# EAGLE design Chime PCB v2 (EAGLE 9.6.2)
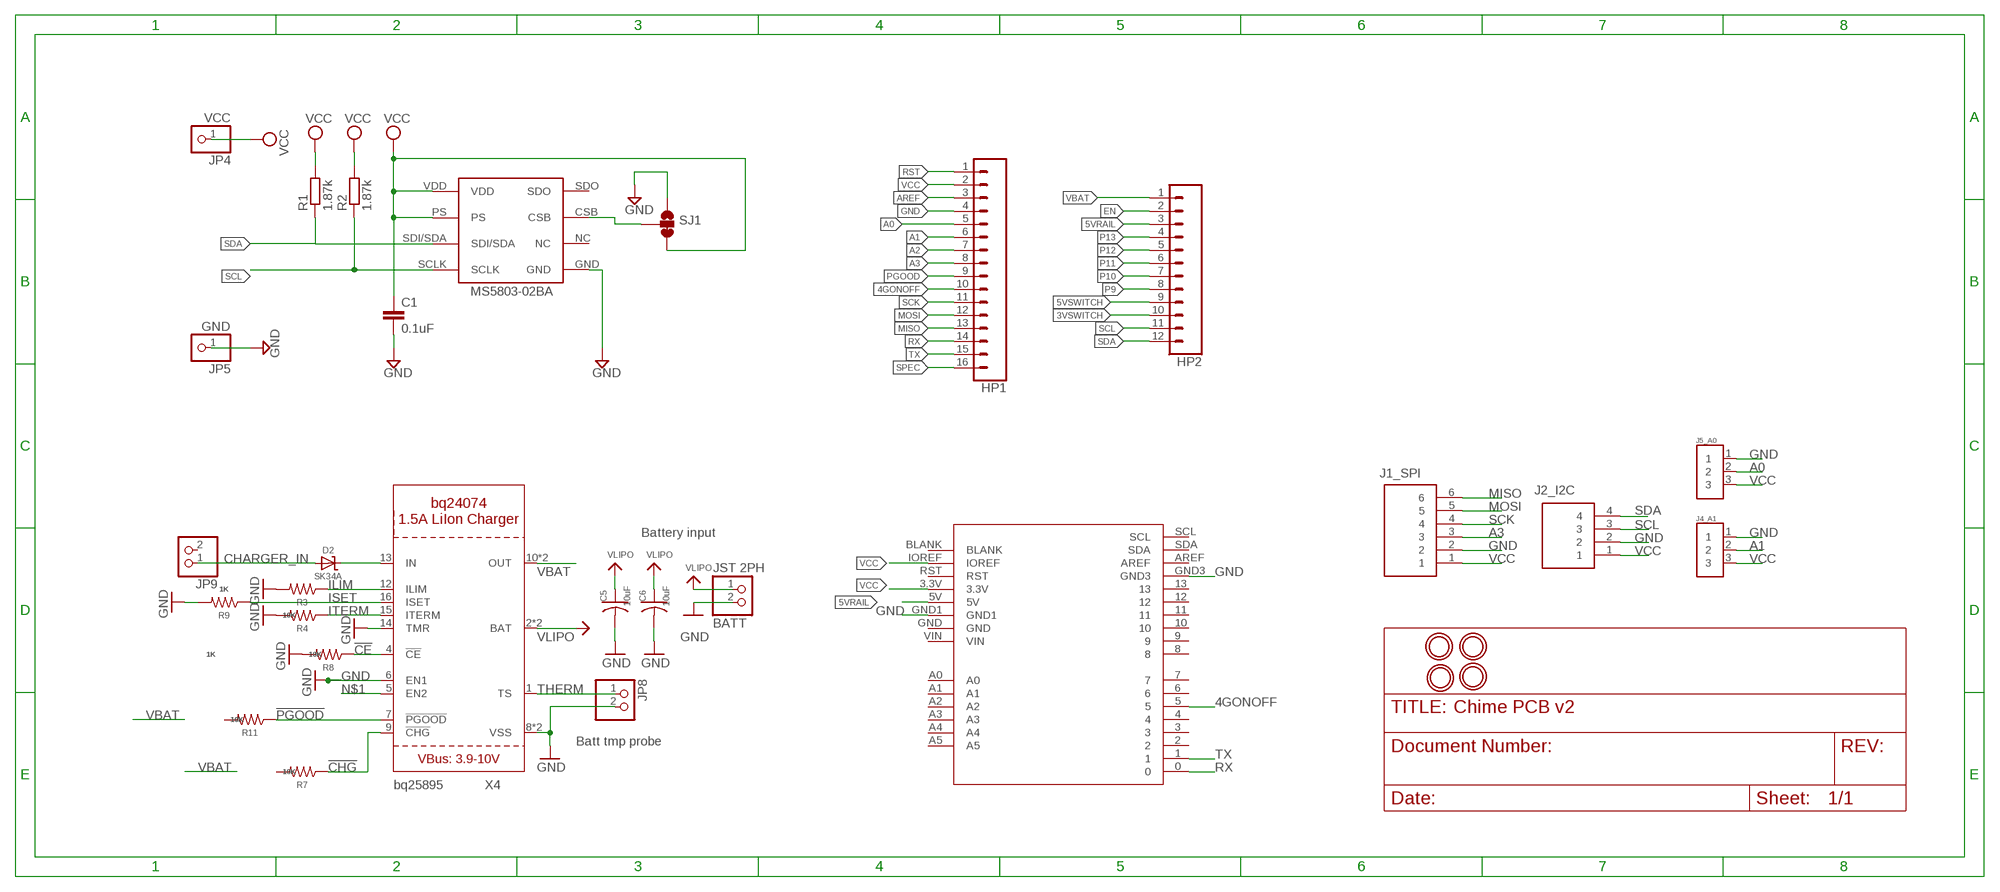
[diagram p0: schematic, sheet 1]

## Parts
BATT  JST 2PH  JST_2PIN-SMT-RA  [JST-PH-2-SMT-RA]
C1  0.1uF  C-EUC0805  [C0805]
C5  10uF  C-USC0805K  [C0805K]
C6  10uF  C-USC0805K  [C0805K]
D2  SK34A  DIODE-SCHOTTKYSMA  [SMADIODE]
HP1  CONN_16  [1X16]
HP2  CONN_12  [1X12]
J1_SPI  1725698  [1725698]
J2_I2C  1725672  [1725672]
J4_A1  282834-3  [TE_282834-3]
J5_A0  282834-3  [TE_282834-3]
JP4  VCC  PINHD-1X1  [1X01]
JP5  GND  PINHD-1X1  [1X01]
JP8  PINHD-1X2  [1X02]
JP9  PINHD-1X2  [1X02]
R1  1.87k  R-EU_R0805  [R0805]
R2  1.87k  R-EU_R0805  [R0805]
R3  1K  R-US_M0805  [M0805]
R4  10K  R-US_M0805  [M0805]
R7  10K  R-US_M0805  [M0805]
R8  10K  R-US_M0805  [M0805]
R9  1K  R-US_M0805  [M0805]
R11  10K  R-US_M0805  [M0805]
SJ1  JUMPER-SMT_3_1-NC_TRACE_SILK  [SMT-JUMPER_3_1-NC_TRACE_SILK]
U1  MS5803-02BA  [MS5803-02BA]
U$1  LTE_BOARD  [LTE_BOARD_FOOTPRINT]
U$2  MOUNTINGHOLE2.5  [MOUNTINGHOLE_2.5_PLATED]
U$3  MOUNTINGHOLE2.5  [MOUNTINGHOLE_2.5_PLATED]
U$4  MOUNTINGHOLE2.5  [MOUNTINGHOLE_2.5_PLATED]
U$5  MOUNTINGHOLE2.5  [MOUNTINGHOLE_2.5_PLATED]
X4  BQ24074  [QFN16_3MM]

## Nets
3VSWITCH: HP2.10
4GONOFF: HP1.10 U$1.5
5VRAIL: HP2.3 U$1.5V
5VSWITCH: HP2.9
!CE: R8.1 X4.4(!CE)
!CHG: R7.1 X4.9(!CHG)
!PGOOD: R11.1 X4.7(!PGOOD)
A0: HP1.5 J5_A0.2
A1: HP1.6 J4_A1.2
A2: HP1.7
A3: HP1.8 J1_SPI.3
AREF: HP1.3
CHARGER_IN: D2.A JP9.1
EN: HP2.2
GND: BATT.2 C1.2 C5.2 C6.2 HP1.4 J1_SPI.2 J2_I2C.2 J4_A1.1 J5_A0.1 JP5.1 JP8.2 R3.2 R4.2 R8.2 R9.2 SJ1.1 U1.GND U$1.GND1 U$1.GND3 X4.6(EN1) X4.8(VSS) X4.14(TMR) X4.THERMAL(VSS)
ILIM: R3.1 X4.12(ILIM)
ISET: R9.1 X4.16(ISET)
ITERM: R4.1 X4.15(ITERM)
MISO: HP1.13 J1_SPI.6
MOSI: HP1.12 J1_SPI.5
N$1: X4.5(EN2)
N$2: D2.C X4.13(IN)
N$3: SJ1.2 U1.CSB
P9: HP2.8
P10: HP2.7
P11: HP2.6
P12: HP2.5
P13: HP2.4
PGOOD: HP1.9
RST: HP1.1
RX: HP1.14 U$1.0
SCK: HP1.11 J1_SPI.4
SCL: HP2.11 J2_I2C.3 R2.1 U1.SCLK
SDA: HP2.12 J2_I2C.4 R1.1 U1.SDI/SDA
SPEC: HP1.16
THERM: JP8.1 X4.1(TS)
TX: HP1.15 U$1.1
VBAT: HP2.1 X4.10(OUT) X4.11(OUT)
VCC: C1.1 HP1.2 J1_SPI.1 J2_I2C.1 J4_A1.3 J5_A0.3 JP4.1 R1.2 R2.2 SJ1.3 U1.PS U1.VDD U$1.3.3V U$1.IOREF
VLIPO: BATT.1 C5.1 C6.1 X4.2(BAT) X4.3(BAT)
Unconnected: JP9.2 R7.2 R11.2 U1.NC U1.SDO U$1.2 U$1.3 U$1.4 U$1.6 U$1.7 U$1.8 U$1.9 U$1.10 U$1.11 U$1.12 U$1.13 U$1.A0 U$1.A1 U$1.A2 U$1.A3 U$1.A4 U$1.A5 U$1.AREF U$1.BLANK U$1.GND U$1.RST U$1.SCL U$1.SDA U$1.VIN

## Notes on the sheet
- Battery input
- Batt tmp probe

## Library data of the parts
BATT = adafruit:JST_2PIN: JST 2-Pin Connectors of various flavors SMT-RA (S2B-PH-SM4) 4UConnector #17311 SMT (B2B-PH-SM4) THM-RA (S2B-PH) THM (B2B-PH)
C1 = rcl:C-EU: CAPACITOR, European symbol; SPICEPREFIX: C
C5 C6 = adafruit:C-US: CAPACITOR, American symbol
D2 = microbuilder:DIODE-SCHOTTKY
HP1 = SparkFun-Connectors:CONN_16: Multi connection point. Often used as Generic Header-pin footprint for 0.1 inch spaced/style header connections On any of the 0.1 inch spaced packages, you can populate with these: Break Away Headers - Straight <https://www.sparkfun.com/products/116> (PRT-00116) Break Away Male Headers - Right Angle <https://www.sparkfun.com/products/553> (PRT-00553) Female Headers <https://www.sparkfun.com/products/115> (PRT-00115) Break Away Headers - Machine Pin <https://www.sparkfun.com/products/117> (PRT-00117) Break Away Female Headers - Swiss Machine Pin <https://www.sparkfun.com/products/743> (PRT-00743) For SCREWTERMINALS and SPRING TERMINALS visit here: Screw Terimnals on SparkFun.com <https://www.sparkfun.com/search/results?term=Screw+Terminals> (5mm/3.5mm/2.54mm spacing) This device is also useful as a general connection point to wire up your design to another part of your project. Our various solder wires solder well into these plated through hole pads. Hook-Up Wire - Assortment (Stranded, 22 AWG) <https://www.sparkfun.com/products/11375> (PRT-11375) Hook-Up Wire - Assortment (Solid Core, 22 AWG) <https://www.sparkfun.com/products/11367> (PRT-11367) View the entire wire category on our website here <https://www.sparkfun.com/categories/141> Special notes: Molex polarized connector foot print use with SKU : PRT-08231 with associated crimp pins and housings. 1MM SMD Version SKU: PRT-10208 NOTES ON THE VARIANTS LOCK and LOCK_LONGPADS... This footprint was designed to help hold the alignment of a through-hole component (i.e. 6-pin header) while soldering it into place. You may notice that each hole has been shifted either up or down by 0.005 of an inch from it's more standard position (which is a perfectly straight line). This slight alteration caused the pins (the squares in the middle) to touch the edges of the holes. Because they are alternating, it causes a "brace" to hold the component in place. 0.005 has proven to be the perfect amount of "off-center" position when using our standard breakaway headers. Although looks a little odd when you look at the bare footprint, once you have a header in there, the alteration is very hard to notice. Also,if you push a header all the way into place, it is covered up entirely on the bottom side.
HP2 = SparkFun-Connectors:CONN_12: Multi connection point. Often used as Generic Header-pin footprint for 0.1 inch spaced/style header connections On any of the 0.1 inch spaced packages, you can populate with these: Break Away Headers - Straight <https://www.sparkfun.com/products/116> (PRT-00116) Break Away Male Headers - Right Angle <https://www.sparkfun.com/products/553> (PRT-00553) Female Headers <https://www.sparkfun.com/products/115> (PRT-00115) Break Away Headers - Machine Pin <https://www.sparkfun.com/products/117> (PRT-00117) Break Away Female Headers - Swiss Machine Pin <https://www.sparkfun.com/products/743> (PRT-00743) For SCREWTERMINALS and SPRING TERMINALS visit here: Screw Terimnals on SparkFun.com <https://www.sparkfun.com/search/results?term=Screw+Terminals> (5mm/3.5mm/2.54mm spacing) This device is also useful as a general connection point to wire up your design to another part of your project. Our various solder wires solder well into these plated through hole pads. Hook-Up Wire - Assortment (Stranded, 22 AWG) <https://www.sparkfun.com/products/11375> (PRT-11375) Hook-Up Wire - Assortment (Solid Core, 22 AWG) <https://www.sparkfun.com/products/11367> (PRT-11367) View the entire wire category on our website here <https://www.sparkfun.com/categories/141> Special notes: Molex polarized connector foot print use with SKU : PRT-08231 with associated crimp pins and housings. 1MM SMD Version SKU: PRT-10208 NOTES ON THE VARIANTS LOCK and LOCK_LONGPADS... This footprint was designed to help hold the alignment of a through-hole component (i.e. 6-pin header) while soldering it into place. You may notice that each hole has been shifted either up or down by 0.005 of an inch from it's more standard position (which is a perfectly straight line). This slight alteration caused the pins (the squares in the middle) to touch the edges of the holes. Because they are alternating, it causes a "brace" to hold the component in place. 0.005 has proven to be the perfect amount of "off-center" position when using our standard breakaway headers. Although looks a little odd when you look at the bare footprint, once you have a header in there, the alteration is very hard to notice. Also,if you push a header all the way into place, it is covered up entirely on the bottom side.
J1_SPI = 1725698:1725698: Conn PC Terminal Block 6 POS 2.54mm Solder ST Thru-Hole 6A Source: Datasheet <https://www.phoenixcontact.com/online/portal/us/pxc/product_detail_page/!ut/p/z1/5Vddc6IwFP0r7oNvxYSPBHhEdNda6-KKW-GFISE6tHwVUmn76zeonY7dVmfH8WEH5s6QhHtv7jnJYeYCHyyBn4WbeB3yOM_CRMw9Hwdu3x0OHQXLP2eoD68HyB5OtF_yaKqA38AHfsUSRjmL7JCzdV6-AM-aTJoPPCTAk5tRQekD8B>; ARROW_PART_NUMBER: 1725698; ARROW_PRICE-STOCK: https://www.arrow.com/en/products/1725698/phoenix-contact?region=nac; DESCRIPTION: Conn PC Terminal Block 6 POS 2.54mm Solder ST Thru-Hole 6A; HEIGHT: 8.65mm; MANUFACTURER_NAME: Phoenix Contact; MANUFACTURER_PART_NUMBER: 1725698; MOUSER_PART_NUMBER: 651-1725698; MOUSER_PRICE-STOCK: https://www.mouser.co.uk/ProductDetail/Phoenix-Contact/1725698?qs=Ul7CXFMnlWUIR3VpVwwC4A%3D%3D
J2_I2C = 1725672:1725672: 4 way vertical PCB terminal,6A 63V Phoenix Contact Non-Fused Terminal Block, 4 Way, Solder Terminals, 26 ??? 20 AWG Through Hole, Nylon, 63 V Source: Datasheet <https://datasheet.datasheetarchive.com/originals/distributors/SFDatasheet-2/sf-00050602.pdf>; ARROW_PART_NUMBER: 1725672; ARROW_PRICE-STOCK: https://www.arrow.com/en/products/1725672/phoenix-contact?region=nac; DESCRIPTION: 4 way vertical PCB terminal,6A 63V Phoenix Contact Non-Fused Terminal Block, 4 Way, Solder Terminals, 26 ??? 20 AWG Through Hole, Nylon, 63 V; HEIGHT: 8.65mm; MANUFACTURER_NAME: Phoenix Contact; MANUFACTURER_PART_NUMBER: 1725672; MOUSER_PART_NUMBER: 651-1725672; MOUSER_PRICE-STOCK: https://www.mouser.co.uk/ProductDetail/Phoenix-Contact/1725672?qs=Ul7CXFMnlWXX93F9bOV2pQ%3D%3D
J4_A1 J5_A0 = Fixed Terminal Blocks 3P:282834-3: Conn; Term Blk; PCB; Wire Receptacle; 3; 2.54mm; 30-16AWG; Green; 10A; 150V; M1.6 Check availability <https://pricing.snapeda.com/parts/282834-3/TE%20Connectivity/view-part?ref=eda>; AVAILABILITY: In Stock; COMMENT: 282834-3; DESCRIPTION: 3 Position Wire to Board Terminal Block Horizontal with Board 0.100 (2.54mm); EU_ROHS_COMPLIANCE: Compliant with Exemptions; MF: TE Connectivity; MP: 282834-3; PACKAGE: None; PRICE: None; PURCHASE-URL: https://pricing.snapeda.com/search/part/282834-3/?ref=eda
JP4 JP5 = pinhead_simple:PINHD-1X1: PIN HEADER
JP8 JP9 = pinhead:PINHD-1X2: PIN HEADER
R1 R2 = rcl:R-EU_: RESISTOR, European symbol; SPICEPREFIX: R
R3 R4 R7-R9 R11 = adafruit:R-US_: RESISTOR, American symbol
SJ1 = SparkFun-Jumpers:JUMPER-SMT_3_1-NC_TRACE: Normally closed trace jumper (1 of 2 connections) This jumper has a trace between two pads so it's normally closed (NC). The other connection is normally open (NO). Use a razor knife to open the connection. For best results follow the IPC guidelines for cutting traces: Cutout at least 0.063 mm (0.005 in). Remove all loose material to clean up the cut area. Seal the cut with an approved epoxy. Reapply solder to reclose the connection, or to close the NO connection.
U1 = PNNL_Probe:MS5803-02BA
U$1 = LTE_BOARD_LOOM:LTE_BOARD: LTE_BOARD
U$2-U$5 = microbuilder:MOUNTINGHOLE: Mounting Hole For #2 screws (0.086"/2.18mm width, 0.094"/2.4mm hole) use 2.5mm; BOM: EXCLUDE
X4 = adafruit_power:BQ24074

## Board
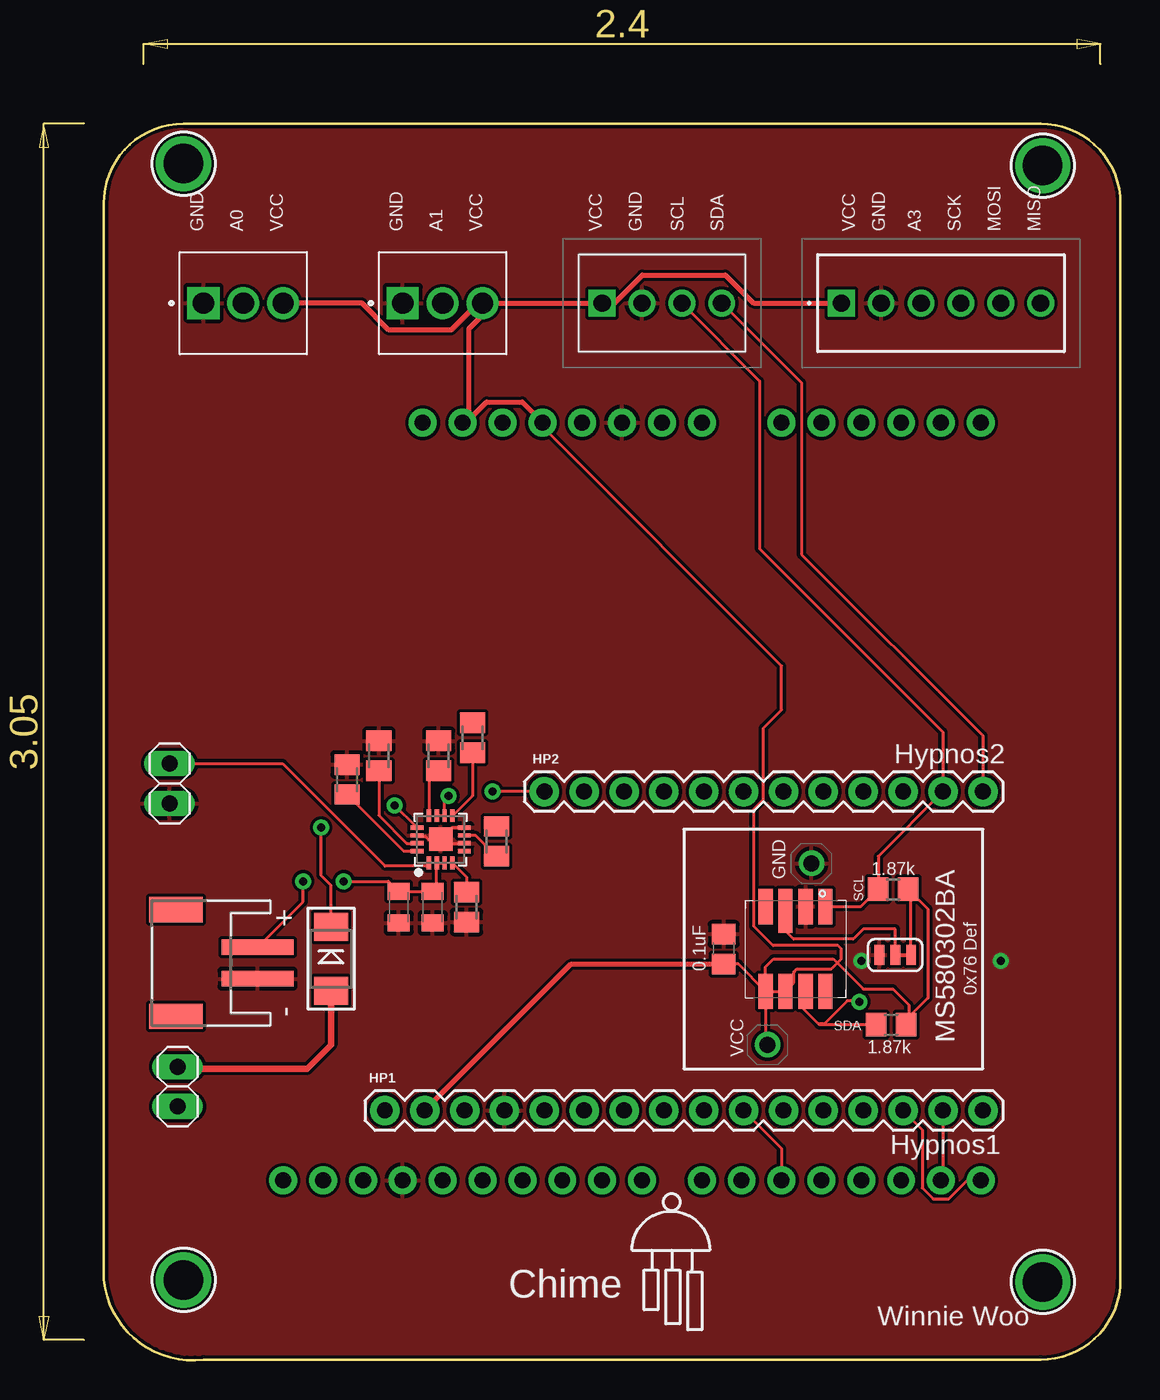
[diagram p1: board, top side]
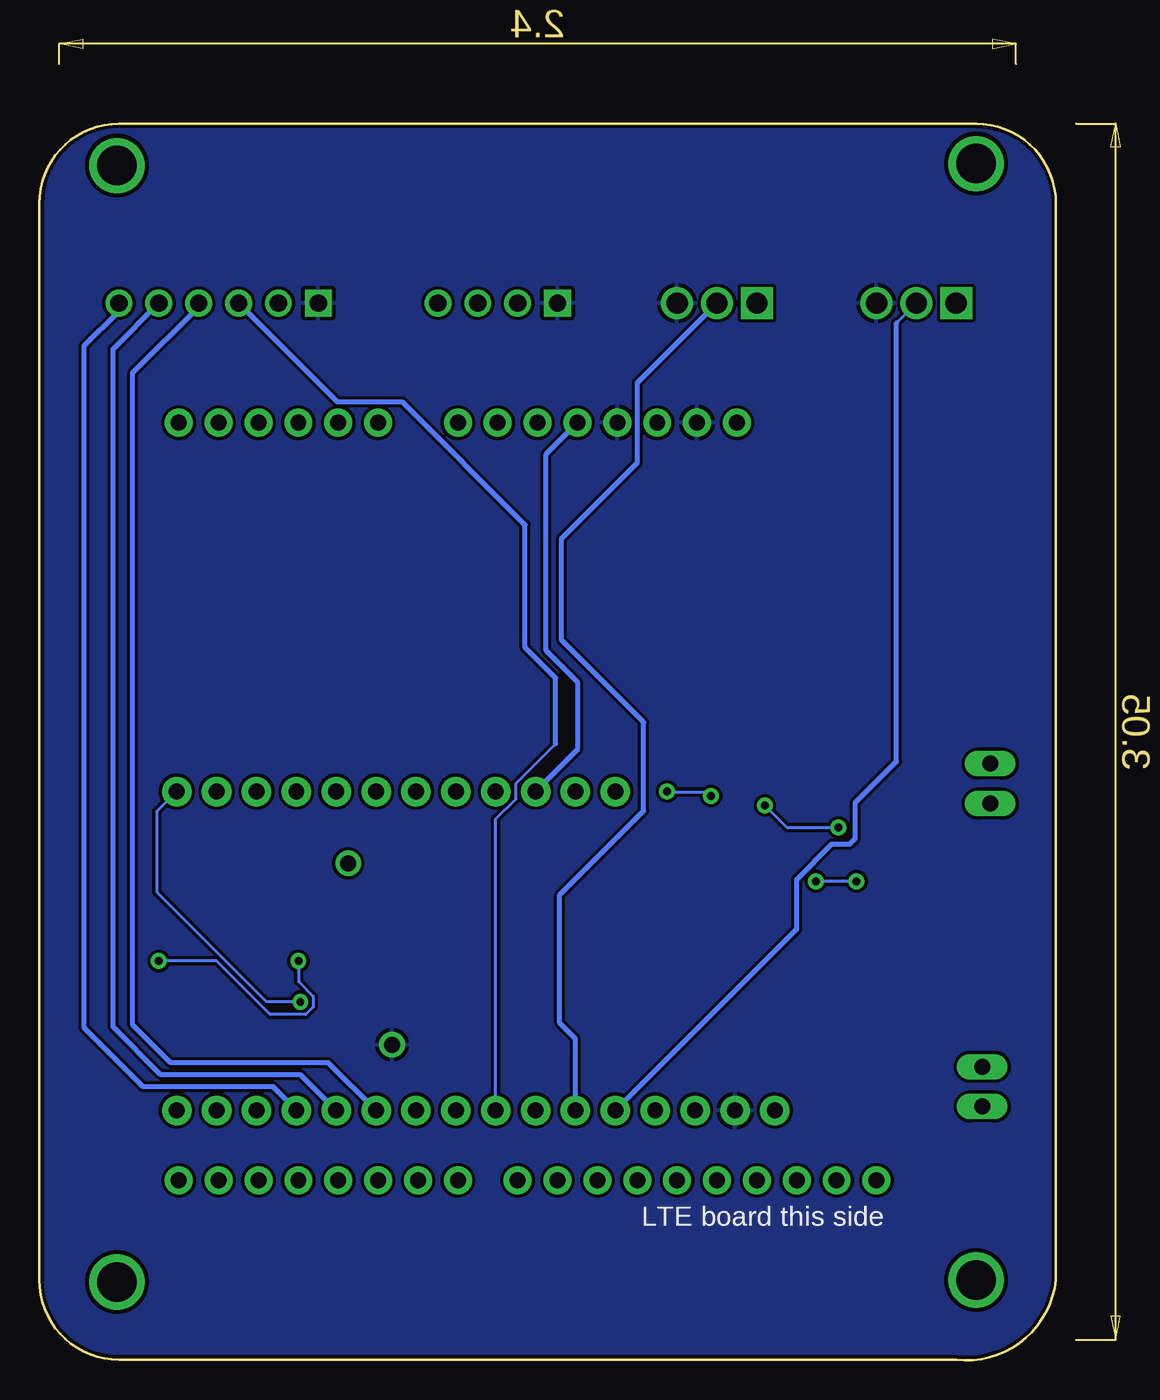
[diagram p2: board, bottom side, seen from below]

Size 64.77 x 78.77 mm. Coordinates in mm from the lower left corner, seen from the top.
Outline: 5.08,78.77 59.69,78.77 arc-90 64.77,73.69 64.77,5.11 arc-90 59.69,0.03 6.35,0.03 arc-90 0,5.11 0,73.69 arc-90 5.08,78.77
Copper layers (1*16): Top 0.035mm / dielectric 1.5mm / Bottom 0.035mm
Design rules "SparkFun": minimum track width 8mil, minimum drill 20mil, track to track 8mil, track to pad 8mil, pad to pad 8mil, via to via 8mil, smd to smd 8mil, copper to edge 8mil, drill to drill 8mil, minimum pad ring 12mil, minimum via ring 10mil, stop-mask expansion 4mil, vias tented up to drill 20mil, thermal gap 10mil

### Footprints (pad centres in the part's own frame; a part is rotated, then mirrored left to right if it is on the bottom)
JST-PH-2-SMT-RA = smd 1 x 4.6: 1 1,-3.7; 2 -1,-3.7 | smd 1.6 x 3.4: NC1 -3.4,1.5; NC2 3.4,1.5
C0805 = smd 1.3 x 1.5: 1 -0.95,0; 2 0.95,0
C0805K = smd 1.1 x 1.4: 1 -1,0; 2 1,0
SMADIODE = smd 1.778 x 2.159: A 2.019,0; C -2.045,0
1X16 = drill 1.016 pad 1.88: 1 0,0; 2 2.54,0; 3 5.08,0; 4 7.62,0; 5 10.16,0; 6 12.7,0; 7 15.24,0; 8 17.78,0; 9 20.32,0; 10 22.86,0; 11 25.4,0; 12 27.94,0; 13 30.48,0; 14 33.02,0; 15 35.56,0; 16 38.1,0
1X12 = drill 1.016 pad 1.88: 1 0,0; 2 2.54,0; 3 5.08,0; 4 7.62,0; 5 10.16,0; 6 12.7,0; 7 15.24,0; 8 17.78,0; 9 20.32,0; 10 22.86,0; 11 25.4,0; 12 27.94,0
1725698 = drill 1.1 pad 1.65 square: 1 0,0 | drill 1.1 pad 1.65: 2 2.54,0; 3 5.08,0; 4 7.62,0; 5 10.16,0; 6 12.7,0
1725672 = drill 1.1 pad 1.65 square: 1 0,0 | drill 1.1 pad 1.65: 2 2.54,0; 3 5.08,0; 4 7.62,0
TE_282834-3 = drill 1.36 square: 1 0,0 | drill 1.36: 2 2.54,0; 3 5.08,0
1X01 = drill 1.016: 1 0,0
1X02 = drill 1.016 long: 1 -1.27,0; 2 1.27,0
R0805 = smd 1.3 x 1.5: 1 -0.95,0; 2 0.95,0
M0805 = smd 1.3 x 1.6: 1 -0.95,0; 2 0.95,0
SMT-JUMPER_3_1-NC_TRACE_SILK = smd 0.635 x 1.27: 1 -1.016,0; 2 0,0; 3 1.016,0
MS5803-02BA = smd 2.8 x 0.9: CSB 2.42,0.65 | smd 2.25 x 0.9: GND 2.7,-0.65; NC 2.7,1.9; PS -2.7,0.65; SCLK 2.7,-1.9; SDI/SDA -2.7,-0.65; SDO -2.7,-1.9; VDD -2.7,1.9
LTE_BOARD_FOOTPRINT = drill 1.016 pad 1.778: 0 35.56,48.26; 1 33.02,48.26; 2 30.48,48.26; 3 27.94,48.26; 3.3V 7.62,0; 4 25.4,48.26; 5 22.86,48.26; 5V 10.16,0; 6 20.32,48.26; 7 17.78,48.26; 8 13.97,48.26; 9 11.43,48.26; 10 8.89,48.26; 11 6.35,48.26; 12 3.81,48.26; 13 1.27,48.26; A0 22.86,0; A1 25.4,0; A2 27.94,0; A3 30.48,0; A4 33.02,0; A5 35.56,0; AREF -3.81,48.26; BLANK 0,0; GND 15.24,0; GND1 12.7,0; GND3 -1.27,48.26; IOREF 2.54,0; RST 5.08,0; SCL -8.89,48.26; SDA -6.35,48.26; VIN 17.78,0
MOUNTINGHOLE_2.5_PLATED = drill 2.5 pad 3.2: P$1 0,0
QFN16_3MM = smd 0.8 x 0.28: 1 -1.5,0.75; 2 -1.5,0.25; 3 -1.5,-0.25; 4 -1.5,-0.75; 9 1.5,-0.75; 10 1.5,-0.25; 11 1.5,0.25; 12 1.5,0.75 | smd 0.28 x 0.8: 5 -0.75,-1.5; 6 -0.25,-1.5; 7 0.25,-1.5; 8 0.75,-1.5; 13 0.75,1.5; 14 0.25,1.5; 15 -0.25,1.5; 16 -0.75,1.5 | smd 1.5 x 1.5: THERMAL 0,0

### Placement (x,y rotation side)
BATT  6.1,25.31 90 top
C1  39.5,26.2 90 top
C5  20.95,28.86 270 top
C6  18.8,28.86 270 top
D2  14.48,25.56 270 top
HP1  17.91,15.91 0 top
HP2  28.07,36.23 0 top
J1_SPI  46.99,67.34 0 top
J2_I2C  31.75,67.34 0 top
J4_A1  19.05,67.34 0 top
J5_A0  6.35,67.34 0 top
JP4  42.29,20.1 90 top
JP5  45.09,31.66 90 top
JP8  4.19,36.74 270 top
JP9  4.7,17.43 270 top
R1  50.17,21.37 0 top
R2  50.29,30.01 0 top
R3  21.34,38.52 90 top
R4  17.53,38.52 90 top
R7  23.5,39.66 90 top
R8  23.11,28.86 270 top
R9  15.49,36.99 90 top
R11  25.02,33.05 90 top
SJ1  50.42,25.82 0 top
U1  44.07,26.2 90 top
U$1  20.32,59.72 180 bottom
U$2  5.08,5.11 0 top
U$3  5.08,76.23 0 top
U$4  59.82,76.11 0 top
U$5  59.82,4.99 0 top
X4  21.46,33.18 90 top

### Tracks (layer width: path | path; a pad name or v marks a point on that pad's centre or on a via)
4GONOFF
  Top 0.203: HP1.10 43.18,13.5 U$1.5
5VRAIL
  Bottom 0.305: HP2.3 30.48,38.9 30.48,43.21 32.51,45.25 32.51,57.69 U$1.5V
!CE
  Top 0.203: X4.4 23.11,30.78 R8.1
!CHG
  Top 0.203: R7.1 23.5,35.96 X4.9
!PGOOD
  Top 0.203: R11.1 23.69,33.43 X4.7
A0
  Bottom 0.203: 10.16,66.07 J5_A0.2
  Bottom 0.305: 10.16,66.07 10.16,38.13 12.78,35.52 12.78,33.23 13.12,32.88 14.28,32.88 16.51,30.64 16.51,27.47 HP1.5
A1
  Bottom 0.305: J4_A1.2 26.67,62.26 26.67,57.18 31.5,52.36 31.5,45.88 26.26,40.65 26.26,35 31.62,29.64 31.62,21.5 30.61,20.48 HP1.6
A3
  Bottom 0.203: HP1.8 35.69,34.47 34.39,35.76 34.39,36.75 31.88,39.26
  Bottom 0.305: J1_SPI.3 45.77,61.05 41.63,61.05 33.81,53.22 33.81,45.4 31.88,43.47 31.88,39.26
CHARGER_IN
  Top 0.203: JP9.1 4.83,18.58
  Top 0.406: 4.83,18.58 12.95,18.58 14.48,20.1 D2.A
GND  (via drill 0.51)
  Top 0.203: X4.14 20.02,33.38 20.49,33.38 20.68,33.18 X4.THERMAL | X4.THERMAL 21.71,32.93 X4.6 | X4.THERMAL 22.21,33.93 X4.8
  Bottom 0.203: v57.15,25.43 53.46,25.43 50.05,22.03 47.8,22.03 47.32,22.51 47.32,23.18 48.26,24.12 v48.26,25.43
  pour Top: 0,78.77 64.77,78.77 64.77,0.03 0,0.03
  pour Top: 0,78.77 64.77,78.77 64.77,0.03 0,0.03
ILIM
  Top 0.203: R3.1 20.71,36.94 X4.12
ISET
  Top 0.203: R9.1 19.1,32.43 X4.16
ITERM
  Top 0.203: R4.1 17.53,34.71 19.31,32.93 X4.15
MISO
  Bottom 0.305: J1_SPI.6 59.69,66.84 61.94,64.59 61.94,21.2 58.17,17.43 49.91,17.43 HP1.13
MOSI
  Bottom 0.305: HP1.12 48.13,18.2 57.02,18.2 60.07,21.24 60.07,64.42 J1_SPI.5
N$2  (via drill 0.51)
  Top 0.203: X4.13 v18.54,35.34 | D2.C 14.48,30.26 13.84,30.9 v13.84,33.94
  Bottom 0.203: v18.54,35.34 17.14,33.94 v13.84,33.94
N$3
  Top 0.203: U1.CSB 43.42,27.35 43.94,26.83 47.75,26.83 48.39,27.47 50.42,27.47 SJ1.2
RX
  Top 0.203: HP1.14 52.15,14.69 52.15,10.97 52.85,10.27 53.83,10.27 55.03,11.46 U$1.0
SCK
  Bottom 0.305: HP1.11 46.36,18.96 56.39,18.96 58.8,21.37 58.8,62.91 54.61,67.1 J1_SPI.4
SCL
  Top 0.203: U1.SCLK 48.23,28.9 R2.1 49.34,32.1 HP2.11 53.47,40.02 41.78,51.71 41.78,62.39 J2_I2C.3
SDA  (via drill 0.51)
  Top 0.203: R1.1 45.59,21.37 45.53,21.43 | 45.53,21.43 44.58,22.39 44.58,23.35 U1.SDI/SDA | v48.13,22.84 48.08,22.89 47.37,22.89 45.91,21.43 45.53,21.43 | J2_I2C.4 44.45,62.26 44.45,51.34 56.01,39.79 HP2.12
  Bottom 0.203: v48.13,22.84 50.29,22.84 57.28,29.83 57.28,34.96 HP2.12
THERM
  Top 0.203: JP8.1 11.39,38.01 17.92,31.48 20.51,31.48 X4.1
TX
  Top 0.203: HP1.15 53.47,11.59 U$1.1
VBAT  (via drill 0.51)
  Top 0.203: HP2.1 v24.77,36.23 | v21.97,35.95 21.71,35.69 X4.10 X4.11
  Bottom 0.203: v24.77,36.23 24.74,36.2 22.22,36.2 v21.97,35.95
VCC
  Top 0.203: U1.VDD U1.PS 43.96,24.04 43.96,24.75 44.14,24.93 46.36,24.93 46.99,25.56 46.99,26.21 46.78,26.43 42.63,26.43 41.41,27.65 41.41,35.12 42.01,35.71 42.01,40.27 43.18,41.44 43.18,44.23 27.94,59.47 | U1.VDD 40.42,25.25 C1.1 | U1.VDD 42.17,25.06 42.67,25.56 46.48,25.56 48.39,23.66 50.28,23.66 51.31,22.63 51.31,21.88 | R1.2 51.05,21.43 51.05,21.62 51.31,21.88 | U1.VDD 42.17,20.22 JP4.1 | SJ1.3 51.44,29.75 51.21,29.98 R2.2 52.51,28.74 52.51,23.08 51.31,21.88
  Top 0.305: HP1.2 29.78,25.25 C1.1 | J1_SPI.1 41.39,67.34 39.6,69.14 34.32,69.14 32.52,67.34 J2_I2C.1 J4_A1.3 | 27.94,59.47 U$1.3.3V 27.94,59.76 26.66,61.05 24.4,61.05 23.08,59.72 U$1.IOREF 23.24,60.11 23.24,65.69 24.13,66.58 J4_A1.3 | J4_A1.3 23.84,67.34 22.14,65.64 18.16,65.64 16.45,67.34 J5_A0.3
  pour Bottom: 0,78.77 64.77,78.77 64.77,0.03 0,0.03
VLIPO  (via drill 0.51)
  Top 0.203: BATT.1 12.7,29.21 v12.7,30.51 | v15.29,30.51 18.14,30.51 C6.1 C5.1 21.21,30.12 X4.2 X4.3
  Bottom 0.203: v12.7,30.51 v15.29,30.51

### Text on the board
tPlace: GND | A0 | VCC | GND | A1 | VCC | VCC | GND | SCL | SDA | VCC | GND | A3 | SCK | MOSI | MISO | Hypnos2 | 1.87k | GND | SCL | 0.1uF | 0x76 Def | SDA | 1.87k | MS580302BA | VCC | Hypnos1 | Chime | Winnie Woo
bNames: LTE board this side